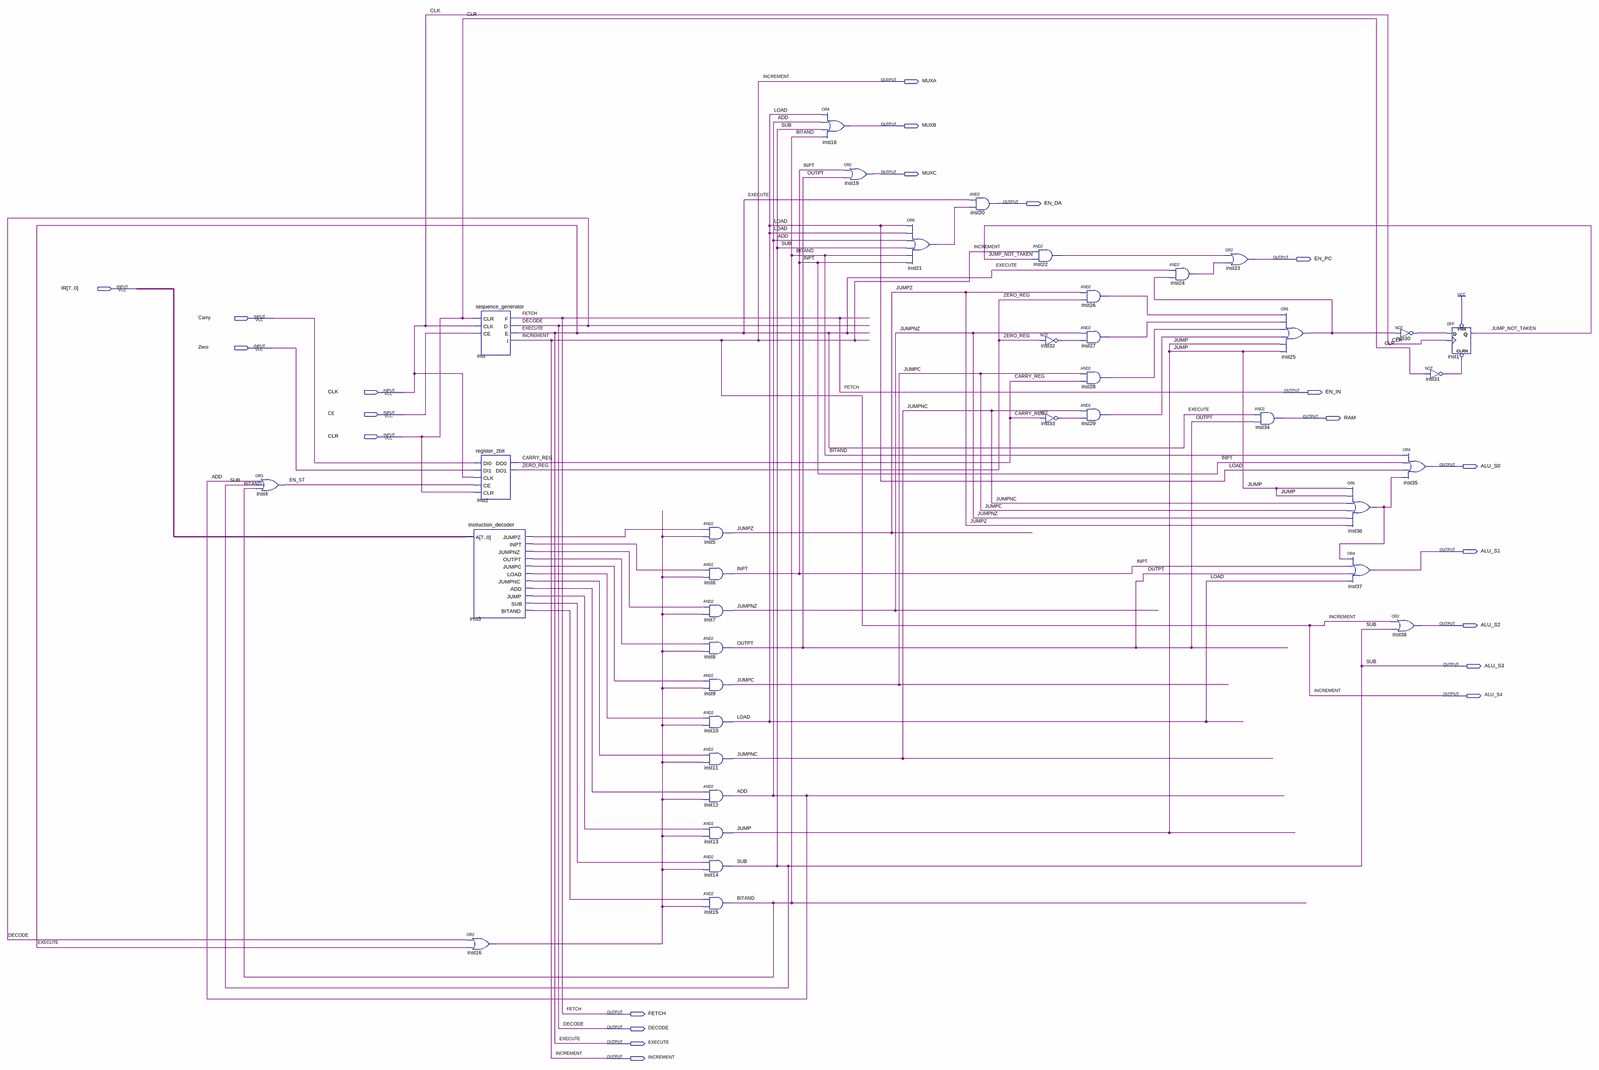
[diagram p0: schematic sheet, whole]
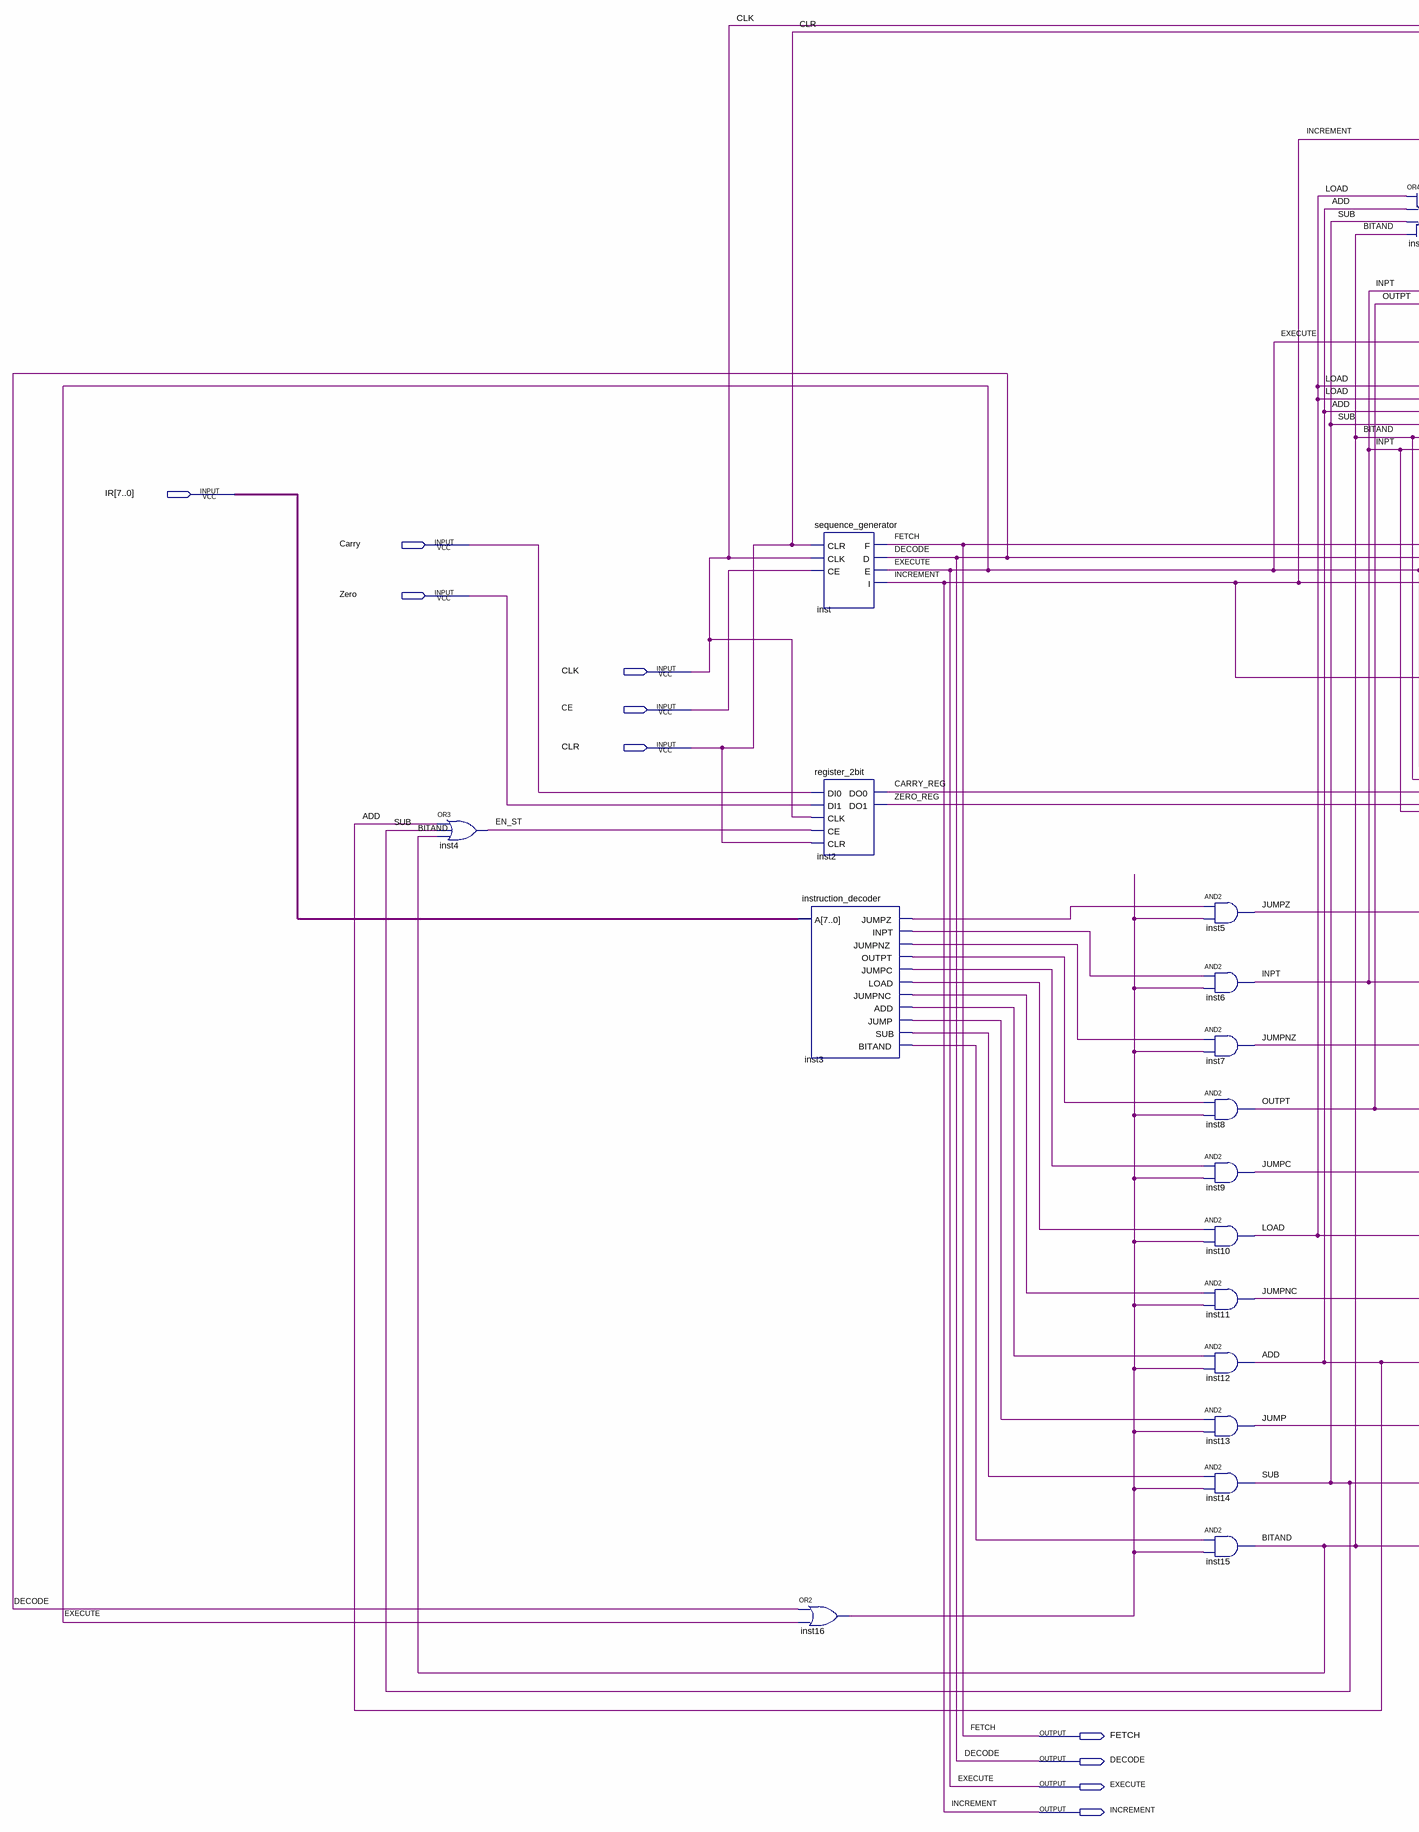
[diagram p1: schematic sheet, left part]
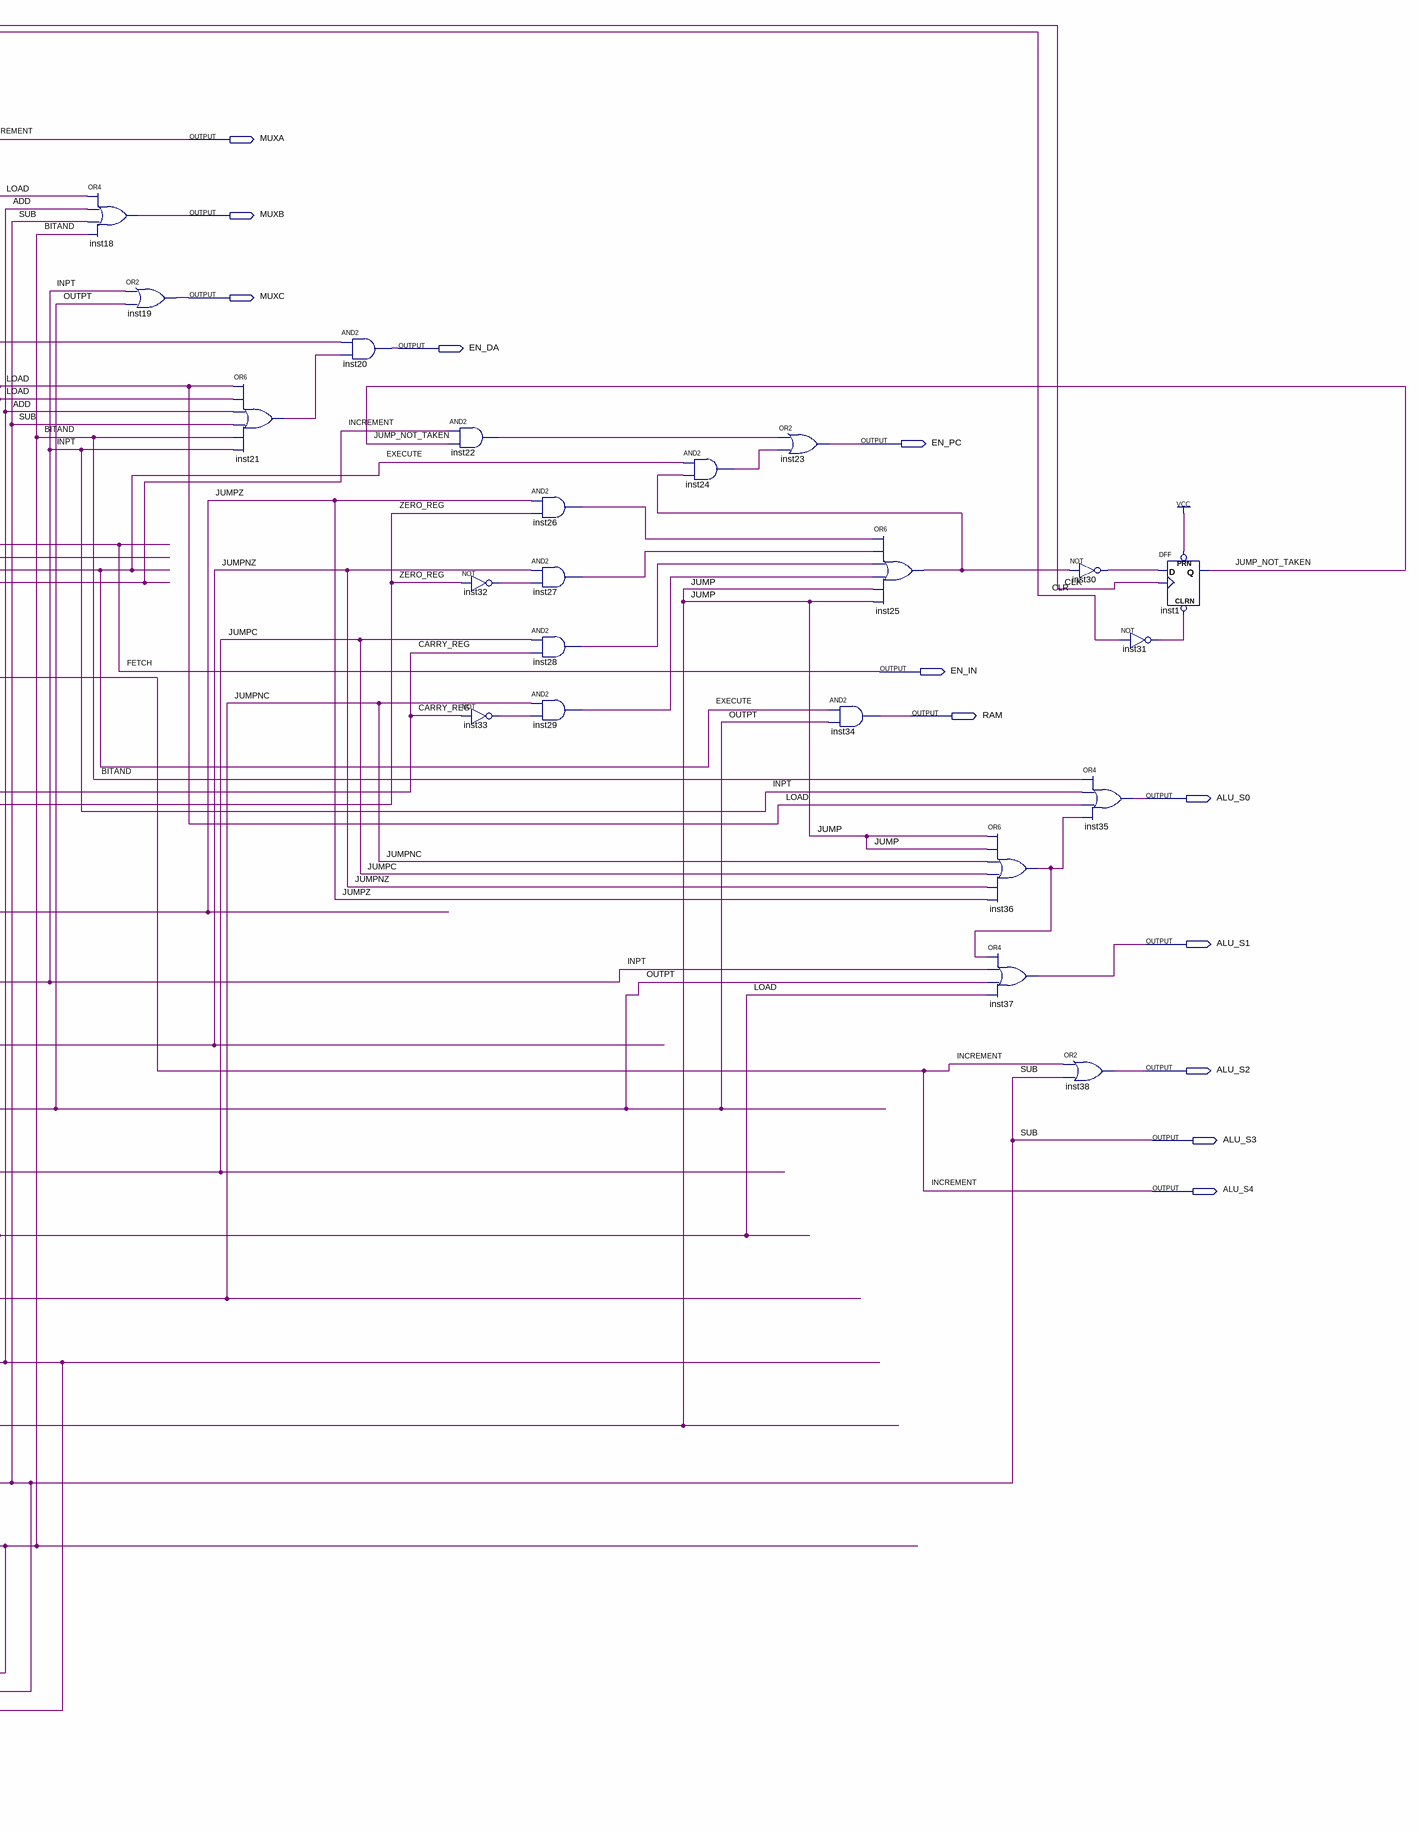
[diagram p2: schematic sheet, right part]
// Quartus schematic decoder.bdf as structural Verilog: 38 symbols, 22 pins
module decoder (
  input  [7:0] IR,
  input  Carry,
  input  Zero,
  input  CLK,
  input  CE,
  input  CLR,
  output MUXA,
  output MUXB,
  output MUXC,
  output EN_DA,
  output EN_PC,
  output EN_IN,
  output RAM,
  output ALU_S0,
  output ALU_S1,
  output ALU_S2,
  output ALU_S3,
  output ALU_S4,
  output FETCH,
  output DECODE,
  output EXECUTE,
  output INCREMENT
);

  wire ADD, BITAND, CARRY_REG, EN_ST, INPT, inst3_add, inst3_bitand, inst3_inpt, inst3_jump, inst3_jumpc,
       inst3_jumpnc, inst3_jumpnz, inst3_jumpz, inst3_load, inst3_outpt, inst3_sub, inst16_out, inst21_out,
       inst22_out, inst24_out, inst25_out, inst26_out, inst27_out, inst28_out, inst29_out, inst30_out,
       inst31_out, inst32_out, inst33_out, inst36_out, JUMP, JUMP_NOT_TAKEN, JUMPC, JUMPNC, JUMPNZ, JUMPZ,
       LOAD, OUTPT, ZERO_REG;

  or inst4 (EN_ST, ADD, ALU_S3, BITAND);
  sequence_generator inst (.CLR(CLR), .CLK(CLK), .CE(CE), .F(EN_IN), .D(DECODE), .E(EXECUTE), .I(ALU_S4));
  register_2bit inst2 (.DI0(Carry), .DI1(Zero), .CLK(CLK), .CE(EN_ST), .CLR(CLR), .DO0(CARRY_REG), .DO1(ZERO_REG));
  instruction_decoder inst3 (
    .A(IR), .JUMPZ(inst3_jumpz), .INPT(inst3_inpt), .JUMPNZ(inst3_jumpnz), .OUTPT(inst3_outpt),
    .JUMPC(inst3_jumpc), .LOAD(inst3_load), .JUMPNC(inst3_jumpnc), .ADD(inst3_add), .JUMP(inst3_jump),
    .SUB(inst3_sub), .BITAND(inst3_bitand));
  or inst16 (inst16_out, DECODE, EXECUTE);
  and inst5 (JUMPZ, inst3_jumpz, inst16_out);
  and inst6 (INPT, inst3_inpt, inst16_out);
  and inst7 (JUMPNZ, inst3_jumpnz, inst16_out);
  and inst8 (OUTPT, inst3_outpt, inst16_out);
  and inst9 (JUMPC, inst3_jumpc, inst16_out);
  and inst10 (LOAD, inst3_load, inst16_out);
  and inst11 (JUMPNC, inst3_jumpnc, inst16_out);
  and inst12 (ADD, inst3_add, inst16_out);
  and inst13 (JUMP, inst3_jump, inst16_out);
  and inst14 (ALU_S3, inst3_sub, inst16_out);
  and inst15 (BITAND, inst3_bitand, inst16_out);
  or inst18 (MUXB, LOAD, ADD, ALU_S3, BITAND);
  or inst19 (MUXC, INPT, OUTPT);
  or inst21 (inst21_out, LOAD, LOAD, ADD, ALU_S3, BITAND, INPT);
  and inst20 (EN_DA, EXECUTE, inst21_out);
  and inst22 (inst22_out, ALU_S4, JUMP_NOT_TAKEN);
  not inst32 (inst32_out, ZERO_REG);
  not inst33 (inst33_out, CARRY_REG);
  and inst26 (inst26_out, JUMPZ, ZERO_REG);
  and inst27 (inst27_out, JUMPNZ, inst32_out);
  and inst28 (inst28_out, JUMPC, CARRY_REG);
  and inst29 (inst29_out, JUMPNC, inst33_out);
  and inst24 (inst24_out, EXECUTE, inst25_out);
  or inst23 (EN_PC, inst22_out, inst24_out);
  and inst34 (RAM, EXECUTE, OUTPT);
  or inst25 (inst25_out, inst26_out, inst27_out, inst28_out, inst29_out, JUMP, JUMP);
  or inst36 (inst36_out, JUMP, JUMP, JUMPNC, JUMPC, JUMPNZ, JUMPZ);
  or inst37 (ALU_S1, inst36_out, INPT, OUTPT, LOAD);
  or inst38 (ALU_S2, ALU_S4, ALU_S3);
  not inst30 (inst30_out, inst25_out);
  or inst35 (ALU_S0, BITAND, INPT, LOAD, inst36_out);
  DFF inst1 (.CLRN(inst31_out), .CLK(CLK), .D(inst30_out), .PRN(1'b1), .Q(JUMP_NOT_TAKEN));
  not inst31 (inst31_out, CLR);

  assign FETCH = EN_IN;
  assign INCREMENT = ALU_S4;
  assign MUXA = ALU_S4;

  // Other names for the same wires on the sheet: SUB = ALU_S3
endmodule
